# Altium schematic sheet Peripheral.SchDoc
size A4
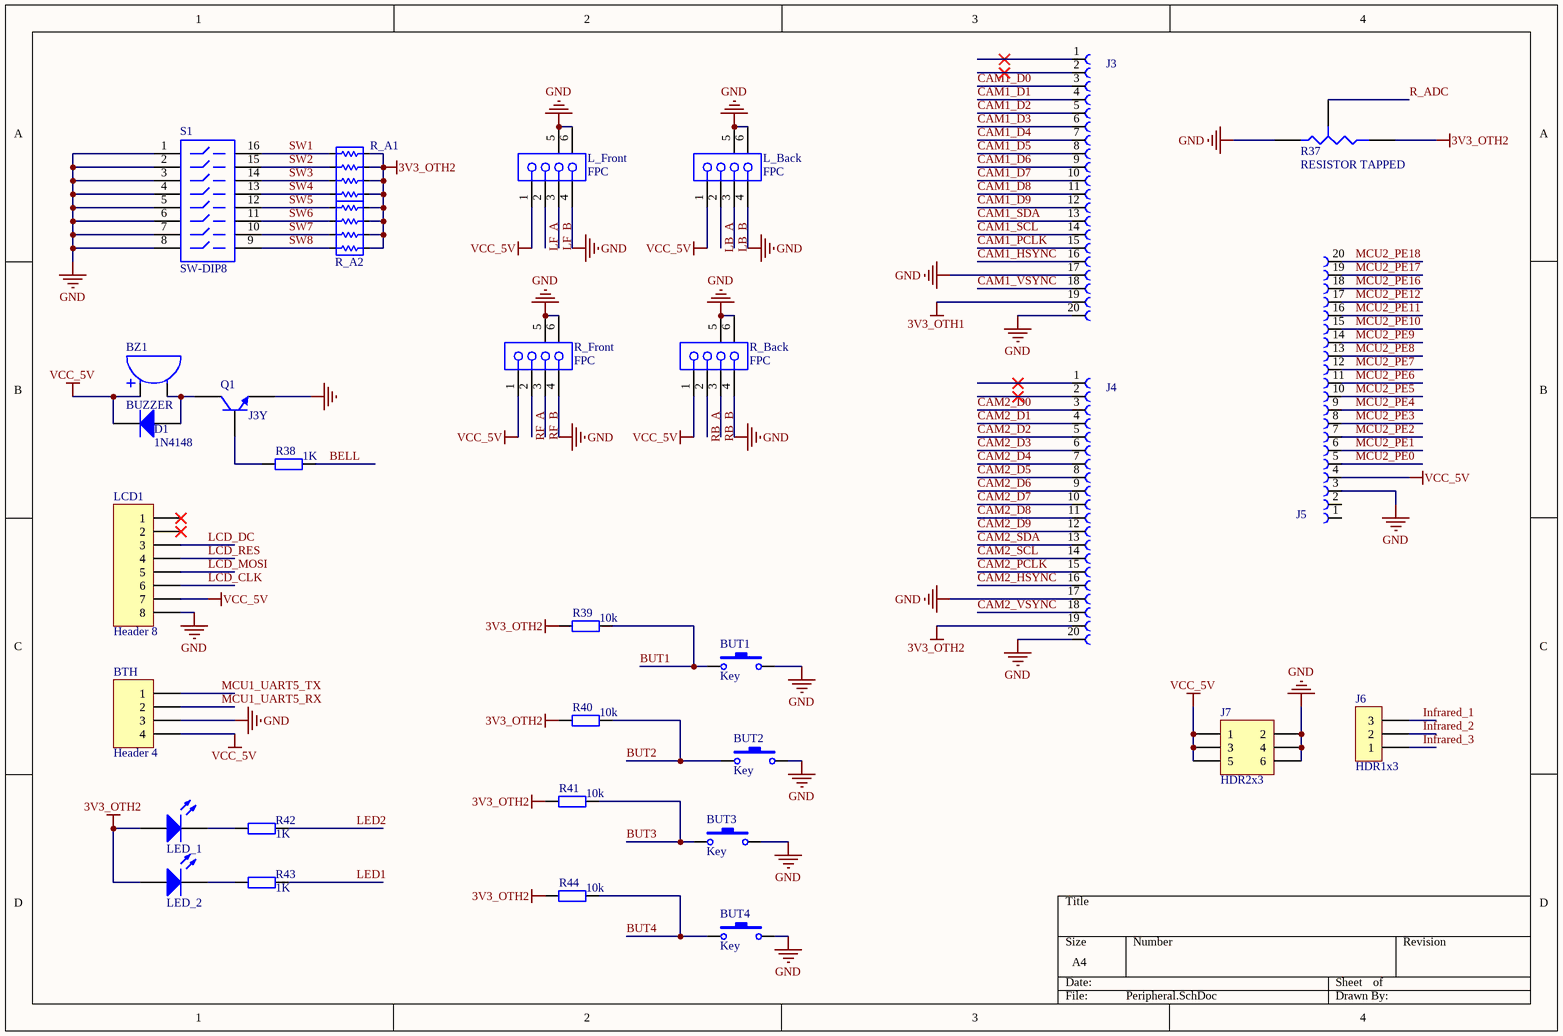
[diagram p0: Peripheral.SchDoc]

## Parts
BTH  Header 4  [HDR1X4]
BUT1  Key  [Key_PB]
BUT2  Key  [Key_PB]
BUT3  Key  [Key_PB]
BUT4  Key  [Key_PB]
BZ1  BUZZER  [BUZZER-D12.0X8.5-6.5-0.8]
D1  1N4148  [1N4148]
J3  (no value)  [*68712014522]
J4  (no value)  [*68712014522]
J5  68712014522  [*68712014522]  (value not drawn)
J6  HDR1x3  [PIN-3-2.54-1.0]
J7  HDR2x3  [PIN-2x3-2.54-1.0]
L_Back  FPC  [FH12-10(4)SA-1SH]
L_Front  FPC  [FH12-10(4)SA-1SH]
LCD1  Header 8  [HDR1X8]
LED_1  LED  [LED]  (value not drawn)
LED_2  LED  [LED]  (value not drawn)
Q1  J3Y  [SOT23]
R37  RESISTOR TAPPED  [0932电位器]
R38  1K  [0805]
R39  value 10k  [0805]  (hidden comment: Res2)
R40  value 10k  [0805]  (hidden comment: Res2)
R41  value 10k  [0805]  (hidden comment: Res2)
R42  value 1K  [0805]  (hidden comment: Res2)
R43  value 1K  [0805]  (hidden comment: Res2)
R44  value 10k  [0805]  (hidden comment: Res2)
R_A1  Res Array  [R_Array]  (value not drawn)
R_A2  Resistor Array  [Res Array]  (value not drawn)
R_Back  FPC  [FH12-10(4)SA-1SH]
R_Front  FPC  [FH12-10(4)SA-1SH]
S1  SW-DIP8  [DIP-16-KEY]

## Nets
3V3_OTH1: J3.19
3V3_OTH2: J4.19 LED_1.1(A) LED_2.1(A) R37.2(B) R39.1 R40.1 R41.1 R44.1 R_A1.5 R_A1.6 R_A1.7 R_A1.8 R_A2.5 R_A2.6 R_A2.7 R_A2.8
GND: BTH.3 BUT1.2 BUT2.2 BUT3.2 BUT4.2 J3.17 J3.20 J4.17 J4.20 J5.3 J7.2 J7.4 J7.6 L_Back.4 L_Back.5(MH1) L_Back.6(MH2) L_Front.4 L_Front.5(MH1) L_Front.6(MH2) LCD1.8 Q1.3(E) R37.1(A) R_Back.4 R_Back.5(MH1) R_Back.6(MH2) R_Front.4 R_Front.5(MH1) R_Front.6(MH2) S1.1 S1.2 S1.3 S1.4 S1.5 S1.6 S1.7 S1.8
VCC_5V: BTH.4 BZ1.1 D1.2(K) J5.4 J7.1 J7.3 J7.5 L_Back.1 L_Front.1 LCD1.7 R_Back.1 R_Front.1
BELL: R38.2
BUT1: BUT1.1 R39.2
BUT2: BUT2.1 R40.2
BUT3: BUT3.1 R41.2
BUT4: BUT4.1 R44.2
CAM1_D0: J3.3
CAM1_D1: J3.4
CAM1_D2: J3.5
CAM1_D3: J3.6
CAM1_D4: J3.7
CAM1_D5: J3.8
CAM1_D6: J3.9
CAM1_D7: J3.10
CAM1_D8: J3.11
CAM1_D9: J3.12
CAM1_HSYNC: J3.16
CAM1_PCLK: J3.15
CAM1_SCL: J3.14
CAM1_SDA: J3.13
CAM1_VSYNC: J3.18
CAM2_D0: J4.3
CAM2_D1: J4.4
CAM2_D2: J4.5
CAM2_D3: J4.6
CAM2_D4: J4.7
CAM2_D5: J4.8
CAM2_D6: J4.9
CAM2_D7: J4.10
CAM2_D8: J4.11
CAM2_D9: J4.12
CAM2_HSYNC: J4.16
CAM2_PCLK: J4.15
CAM2_SCL: J4.14
CAM2_SDA: J4.13
CAM2_VSYNC: J4.18
Infrared_1: J6.3
Infrared_2: J6.2
Infrared_3: J6.1
LB_A: L_Back.2
LB_B: L_Back.3
LCD_CLK: LCD1.6
LCD_DC: LCD1.3
LCD_MOSI: LCD1.5
LCD_RES: LCD1.4
LED1: R43.2
LED2: R42.2
LF_A: L_Front.2
LF_B: L_Front.3
MCU1_UART5_RX: BTH.2
MCU1_UART5_TX: BTH.1
MCU2_PE0: J5.5
MCU2_PE1: J5.6
MCU2_PE2: J5.7
MCU2_PE3: J5.8
MCU2_PE4: J5.9
MCU2_PE5: J5.10
MCU2_PE6: J5.11
MCU2_PE7: J5.12
MCU2_PE8: J5.13
MCU2_PE9: J5.14
MCU2_PE10: J5.15
MCU2_PE11: J5.16
MCU2_PE12: J5.17
MCU2_PE16: J5.18
MCU2_PE17: J5.19
MCU2_PE18: J5.20
R_ADC: R37.3(TAP)
RB_A: R_Back.2
RB_B: R_Back.3
RF_A: R_Front.2
RF_B: R_Front.3
SW1: R_A1.1 S1.16
SW2: R_A1.2 S1.15
SW3: R_A1.3 S1.14
SW4: R_A1.4 S1.13
SW5: R_A2.1 S1.12
SW6: R_A2.2 S1.11
SW7: R_A2.3 S1.10
SW8: R_A2.4 S1.9
NetBZ1_2: BZ1.2 D1.1(A) Q1.1(C)
NetLED_1_2: LED_1.2(K) R42.1
NetLED_2_2: LED_2.2(K) R43.1
NetQ1_2: Q1.2(B) R38.1

Not connected (* = marked no-connect by the designer): J3 1* 2*; J4 1* 2*; J5 1 2; LCD1 1* 2*

## Library data of the parts
BTH = Header 4: Header, 4-Pin; LatestRevisionDate: 17-Jul-2002; LatestRevisionNote: Re-released for DXP Platform.; Publisher: Altium Limited
D1 = Diode: Published: 8-Jun-2000; LatestRevisionDate: 17-Jul-2002; LatestRevisionNote: Re-released for DXP Platform.; PackageDocument: Sep-1996; Publisher: Altium Limited; Code_JEDEC: DO-214-AB
J3 J4 = FPC-0.5-20: WR-FPC 0.5mm ZIF Connector Bottom 20pin; MF: Wurth Electronics; MP: 68712014522; Price: None; Package: None; Availability: Unavailable; SnapEDA_Link: https://www.snapeda.com/parts/68712014522/Wurth%20Electronics%20Inc./view-part/?ref=snap; Value: *
J5 = FPC-0.5-20: WR-FPC 0.5mm ZIF Connector Bottom 20pin; MF: Wurth Electronics; Price: None; Package: None; Availability: Unavailable; SnapEDA_Link: https://www.snapeda.com/parts/68712014522/Wurth%20Electronics%20Inc./view-part/?ref=snap; MP: 68712014522; Value: *
J6 = HDR1x3: Connector
J7 = HDR2x3: Connector
L_Back L_Front R_Back R_Front = CL586-0537-0: FH12 Series, "Flip-Lock" SMT/ZIF Connector - 1.0mm Spaced Bottom Eccentric Contact; Positions: 4; ContactMaterial: Phosphor Bronze; Current: 0.5A; PCB_Layout: Complies with manufacturer's recommendation.; Note: Pad dimensions follow nominal values, Suitable for Wave Soldering, Adjust for Re-flow.; Published: 17-Jul-2002; DatasheetDocument: 13-Nov-2000; PackageDocument: 13-Nov-2000; PackageReference: FH12-10(4)SA-1SH; Publisher: Altium Limited; ComponentLink1Description: Manufacturer Link; ComponentLink1URL: http://www.hiroseusa.com/; ComponentLink2Description: Datasheet; ComponentLink2URL: http://www.hirose.co.jp/cataloge_hp/e58605370.pdf
LCD1 = Header 8: Header, 8-Pin; LatestRevisionDate: 17-Jul-2002; LatestRevisionNote: Re-released for DXP Platform.; Publisher: Altium Limited
Q1 = NPN: NPN Bipolar Transistor; pin to pad: 1>3 2>1 3>2; Published: 8-Jun-2000; LatestRevisionDate: 17-Jul-2002; LatestRevisionNote: Re-released for DXP Platform.; PackageReference: TO-226; Publisher: Altium Limited; Code_JEDEC: TO-226-AA
R38-R44 = Res2: Resistor; Published: 8-Jun-2000; LatestRevisionDate: 17-Jul-2002; LatestRevisionNote: Re-released for DXP Platform.; PackageReference: AXIAL-0.4; Publisher: Altium Limited
  R38: Value: 1K
  R39-R44: PackageDescription: Axial Device, Thru-Hole; 2 Leads; 0.4 in Pin Spacing
R_A1 = R_Array
R_A2 = Res_Array_4: Resistor; Value: 200; Published: 8-Jun-2000; LatestRevisionDate: 17-Jul-2002; LatestRevisionNote: Re-released for DXP Platform.; PackageReference: AXIAL-0.3; Publisher: Altium Limited; PackageDescription: Axial Device, Thru-Hole; 2 Leads; 0.3 in Pin Spacing
S1 = SW-DIP8: 4009 Series DIP Switch, Raised actuator; Published: 24-Mar-1999; LatestRevisionDate: 17-Dec-2003; LatestRevisionNote: PCB Footprint replaced.; PackageReference: DIP-16-KEY; Publisher: Altium Limited; PackageDescription: DIP; 16 Leads; Row Spacing 7.62 mm; Pitch 2.54 mm; ComponentLink1Description: Manufacturer Link; ComponentLink1URL: http://www.oupiin.com/prodindx.html#Headers